# Altium schematic sheet PWR.SchDoc
size A; SheetNumber: 3; SheetTotal: 5
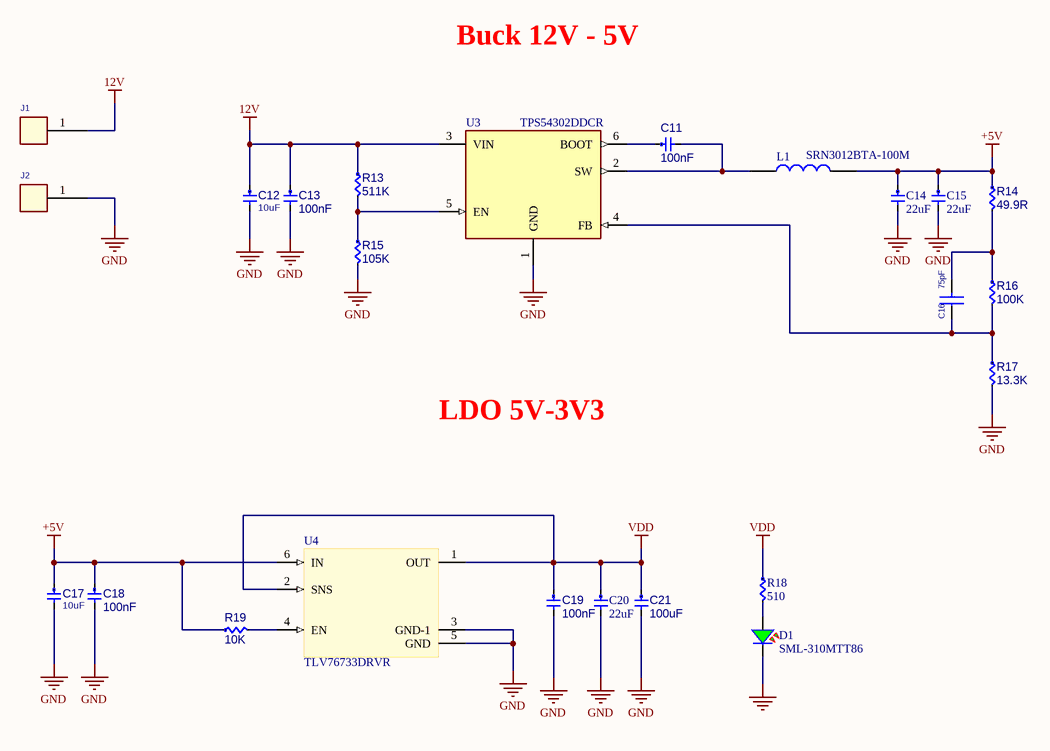
[diagram p0: PWR.SchDoc]

## Parts
C11  Capacitance: 100nF  [CAP0402]  (hidden comment: CC0402KRX5R9BB104)
C12  Capacitance: 10uF  [CAP0603]  (hidden comment: GRM188R6YA106MA73D)
C13  Capacitance: 100nF  [CAP0402]  (hidden comment: CC0402KRX5R9BB104)
C14  Capacitance: 22uF  [CAP0402]  (hidden comment: GRM158R61A226ME15D)
C15  Capacitance: 22uF  [CAP0402]  (hidden comment: GRM158R61A226ME15D)
C16  75pF  [CAP0402]
C17  Capacitance: 10uF  [CAP0603]  (hidden comment: GRM188R6YA106MA73D)
C18  Capacitance: 100nF  [CAP0402]  (hidden comment: CC0402KRX5R9BB104)
C19  Capacitance: 100nF  [CAP0402]  (hidden comment: CC0402KRX5R9BB104)
C20  Capacitance: 22uF  [CAP0402]  (hidden comment: GRM158R61A226ME15D)
C21  Capacitance: 100uF  [CAP0805]  (hidden comment: CL21A107MQYNNWE)
D1  SML-310MTT86  [LED0603 RED]
J1  CON1  [ESC PAD 3X4]  (value not drawn)
J2  CON1  [ESC PAD 3X4]  (value not drawn)
L1  SRN3012BTA-100M  [SRN3012BTA-100M]
R13  511K  [RES0402]
R14  49.9R  [RES0402]
R15  105K  [RES0402]
R16  100K  [RES0402]
R17  13.3K  [RES0402]
R18  Resistance: 510  [RES0402]  (hidden comment: RT0402FRE07510RL)
R19  Resistance: 10K  [RES0402]  (hidden comment: CRCW040210K0JNED)
U3  TPS54302DDCR  [SOT95P280X110-6N - duplicate]
U4  TLV76733DRVR  [SON65P200X200X80-7N - duplicate]

## Nets
12V: C12.1 C13.1 J1.1 R13.1 U3.3(VIN)
+5V: C14.1 C15.1 C17.1 C18.1 L1.2 R14.1 R19.1 U4.6(IN)
GND: C12.2 C13.2 C14.2 C15.2 C17.2 C18.2 C19.2 C20.2 C21.2 D1.1 J2.1 R15.2 R17.2 U3.1(GND) U4.3(GND-1) U4.5(GND)
VDD: C19.1 C20.1 C21.1 R18.1 U4.1(OUT) U4.2(SNS)
NetC11_1: C11.1 U3.6(BOOT)
NetC11_2: C11.2 L1.1 U3.2(SW)
NetC16_1: C16.1 R16.2 R17.1 U3.4(FB)
NetC16_2: C16.2 R14.2 R16.1
NetD1_2: D1.2 R18.2
NetR13_2: R13.2 R15.1 U3.5(EN)
NetR19_2: R19.2 U4.4(EN)

## Notes on the sheet
- Buck 12V - 5V
- LDO 5V-3V3

## Library data of the parts
C11 C13 C18 C19 = CMP-00265-1: CAP CER 0.1UF 50V X5R 0402; Manufacturer: Yageo; Tolerance: 10%; Voltage Rating: 50V; Dielectric: X5R; Width: 0.02inch; Thickness: 0.022inch; Packaging: Tape and Reel; Length: 0.039inch; Mount: Surface Mount; Case/Package: 0402; Min Operating Temperature: -55°C; Halogen Free: Halogen Free; Voltage Rating (DC): 50V; Manufacturer Part Number: CC0402KRX5R9BB104; Max Operating Temperature: 85°C; Lead Free: Lead Free; Manufacturer 1: Yageo; Manufacturer Part Number 1: CC0402KRX5R9BB104
C12 C17 = CMP-01031-1: CAP CER 10UF 35V X5R 0603; Manufacturer 1: Murata Electronics; Tolerance: 20%; Case/Package: 0603; Depth: 0.8mm; Composition: Ceramic; Length: 1.6mm; Max Operating Temperature: 85°C; Lead Free: Lead Free; Thickness: 0.031inch; Number of Pins: 2; Weight: 0.000222oz; Min Operating Temperature: -55°C; REACH SVHC: No SVHC; Case Code (Metric): 1608; Termination: SMD/SMT; Packaging: Tape and Reel; Height: 0.8mm; Voltage Rating (DC): 35V; Width: 0.031inch; Voltage Rating: 35V; Manufacturer Part Number 1: GRM188R6YA106MA73D; Mount: Surface Mount; Package Quantity: 1; Case Code (Imperial): 0603; Dielectric: X5R; Voltage: 35V
C14 C15 C20 = CMP-00520-1: CAP CER 22UF 10V X5R 0402; Manufacturer 1: TDK Corporation; Tolerance: 10%; Case Code (Imperial): 0402; Case/Package: 0402; Voltage: 10V; Min Operating Temperature: -55°C; Termination: SMD/SMT; Voltage Rating: 10V; Length: 1mm; REACH SVHC: No SVHC; Max Operating Temperature: 85°C; Radiation Hardening: No; Depth: 0.5mm; Case Code (Metric): 1005; Dielectric: X5R; Manufacturer Part Number 1: GRM158R61A226ME15D; Packaging: Tape and Reel
C16 = CAP_Dup1_16: CAP CER 75PF 25V C0G/NP0 0402; Manufacturer PN: CC0402JRNPO9BN750; Manufacturer: YAGEO; PART_NUMBER: TMP-416; CLASS: DISCRETE; Tolerance: 5%; Temperature Coefficient: C0G, NP0; Dielectric Type: Capacitors; Rated Voltage: 25V; Package Size: 0402 (1005 Metric)
C21 = CMP-00446-1: CAP CER 100UF 6.3V X5R 0805; Manufacturer 1: TDK Corporation; Tolerance: 20%; Dielectric Material: Ceramic; Length: 2mm; Dielectric: X5R; Height: 1.25mm; Width: 0.049inch; Depth: 1.25mm; Voltage Rating (DC): 6.3V; Manufacturer Part Number 1: CL21A107MQYNNWE; REACH SVHC: No SVHC; Weight: 0.000194oz; Package Quantity: 2000; Mount: Surface Mount; Packaging: Tape and Reel; Case Code (Imperial): 0805; Thickness: 0.057inch; Max Operating Temperature: 85°C; Case/Package: 0805; Case Code (Metric): 2012; Voltage Rating: 6.3V; Termination: SMD/SMT; Composition: Ceramic; Lead Free: Lead Free; Min Operating Temperature: -55°C
D1 = CMP-01130-2: LED GREEN CLEAR 0603 SMD; Manufacturer 1: Rohm Semiconductor; Luminous Intensity: 16mcd; Wavelength: 570nm; Number of LEDs: 1; Color: Green,Yellow; Forward Voltage: 2.2V; Lens Color: Colorless,Clear; Forward Current: 20mA; Viewing Angle: 140°; Lens Style: Rectangular,Clear,Diffused,Colorless; Case Code (Imperial): 0603; Lens Transparency: Clear; Package Quantity: 3000; Width: 0.8mm; Manufacturer Part Number 1: SML-310MTT86; Min Operating Temperature: -30°C; Length: 1.6mm; Packaging: Tape and Reel; Dominant Wavelength: 570nm; Height: 0.9mm; Radiation Hardening: No; Test Current: 20mA; Case Code (Metric): 1608; Lead Free: Lead Free; Case/Package: 0603; Mount: Surface Mount; Max Operating Temperature: 85°C; Illumination Color: Green; Number of Pins: 2
J1 J2 = CON1: SOLDER PADS
L1 = SRN3012BTA-330M: 10uH; Manufacturer_Name: Bourns; Geometry.Height: 1.2mm; Mouser Part Number: SRN3012BTA-100M; Mouser Price/Stock: https://www.mouser.co.uk/ProductDetail/Bourns/SRN3012BTA-330M?qs=Imq1NPwxi74rPoSZ4PPaRw%3D%3D; Manufacturer_Part_Number: SRN3012BTA-100M; Datasheet Link: https://www.bourns.com/docs/Product-Datasheets/SRN3012BTA.pdf
R13 = CMP-00299-1_1: RES SMD 511K OHM 1% 1/16W 0402; Manufacturer: Yageo; Manufacturer Part Number: RC0402FR-07511KL; Temperature Coefficient: 100ppm/°C; Working Voltage: 50V; Max Power Dissipation: 63mW; Power Rating: 62.5mW; Height: 0.016inch; Package Quantity: 1; Min Operating Temperature: -55°C; Tolerance: 1%; Military Standard: Not; Packaging: Tape and Reel; Number of Terminations: 2; Width: 0.02inch; Case/Package: 0402; Length: 1mm; Voltage Rating (DC): 50V; Case Code (Metric): 1005; Resistance: 511K; Composition: Thick Film; Voltage Rating: 50V; Max Operating Temperature: 155°C; Case Code (Imperial): 0402; Lead Free: Lead Free; Termination: SMD/SMT; Features: Moisture Resistant; Depth: 0.5mm; Manufacturer 1: Yageo; Manufacturer Part Number 1: RC0402FR-07511KL
R14 = CMP-00299-1_1: RES SMD 49.9R OHM 1% 1/16W 0402; Manufacturer: Yageo; Manufacturer Part Number: RC0402FR-0749R9L; Temperature Coefficient: 100ppm/°C; Working Voltage: 50V; Max Power Dissipation: 63mW; Power Rating: 62.5mW; Height: 0.016inch; Package Quantity: 1; Min Operating Temperature: -55°C; Tolerance: 1%; Military Standard: Not; Packaging: Tape and Reel; Number of Terminations: 2; Width: 0.02inch; Case/Package: 0402; Length: 1mm; Voltage Rating (DC): 50V; Case Code (Metric): 1005; Resistance: 49.9R; Composition: Thick Film; Voltage Rating: 50V; Max Operating Temperature: 155°C; Case Code (Imperial): 0402; Lead Free: Lead Free; Termination: SMD/SMT; Features: Moisture Resistant; Depth: 0.5mm; Manufacturer 1: Yageo; Manufacturer Part Number 1: RC0402FR-0749R9L
R15 = CMP-00299-1_1: RES SMD 105K OHM 1% 1/16W 0402; Manufacturer: Yageo; Manufacturer Part Number: RC0402FR-07105KL; Temperature Coefficient: 100ppm/°C; Working Voltage: 50V; Max Power Dissipation: 63mW; Power Rating: 62.5mW; Height: 0.016inch; Package Quantity: 1; Min Operating Temperature: -55°C; Tolerance: 1%; Military Standard: Not; Packaging: Tape and Reel; Number of Terminations: 2; Width: 0.02inch; Case/Package: 0402; Length: 1mm; Voltage Rating (DC): 50V; Case Code (Metric): 1005; Resistance: 105K; Composition: Thick Film; Voltage Rating: 50V; Max Operating Temperature: 155°C; Case Code (Imperial): 0402; Lead Free: Lead Free; Termination: SMD/SMT; Features: Moisture Resistant; Depth: 0.5mm; Manufacturer 1: Yageo; Manufacturer Part Number 1: RC0402FR-07105KL
R16 = CMP-00299-1_1: RES SMD 100K OHM 1% 1/16W 0402; Manufacturer: Yageo; Manufacturer Part Number: RC0402FR-07100KL; Temperature Coefficient: 100ppm/°C; Working Voltage: 50V; Max Power Dissipation: 63mW; Power Rating: 62.5mW; Height: 0.016inch; Package Quantity: 1; Min Operating Temperature: -55°C; Tolerance: 1%; Military Standard: Not; Packaging: Tape and Reel; Number of Terminations: 2; Width: 0.02inch; Case/Package: 0402; Length: 1mm; Voltage Rating (DC): 50V; Case Code (Metric): 1005; Resistance: 100K; Composition: Thick Film; Voltage Rating: 50V; Max Operating Temperature: 155°C; Case Code (Imperial): 0402; Lead Free: Lead Free; Termination: SMD/SMT; Features: Moisture Resistant; Depth: 0.5mm; Manufacturer 1: Yageo; Manufacturer Part Number 1: RC0402FR-07100KL
R17 = CMP-00299-1_1: RES SMD 13.3K OHM 1% 1/16W 0402; Manufacturer: Yageo; Manufacturer Part Number: RC0402FR-0713K3L; Temperature Coefficient: 100ppm/°C; Working Voltage: 50V; Max Power Dissipation: 63mW; Power Rating: 62.5mW; Height: 0.016inch; Package Quantity: 1; Min Operating Temperature: -55°C; Tolerance: 1%; Military Standard: Not; Packaging: Tape and Reel; Number of Terminations: 2; Width: 0.02inch; Case/Package: 0402; Length: 1mm; Voltage Rating (DC): 50V; Case Code (Metric): 1005; Resistance: 13.3K; Composition: Thick Film; Voltage Rating: 50V; Max Operating Temperature: 155°C; Case Code (Imperial): 0402; Lead Free: Lead Free; Termination: SMD/SMT; Features: Moisture Resistant; Depth: 0.5mm; Manufacturer 1: Yageo; Manufacturer Part Number 1: RC0402FR-0713K3L
R18 = RC0402FR-0722KL: RES SMD 510 OHM 1% 1/16W 0402; Manufacturer: Yageo; Power Rating: 62.5mW; Temperature Coefficient: 100ppm/°C; Voltage Rating: 50V; Max Power Dissipation: 63mW; Supplier 1: Future Electronics; Manufacturer Part Number: RT0402FRE07510RL; RoHS: Yes; Category: Chip SMD Resistors; Stock 1: 1010000; Pricing 1: 10000=0.00100, 50000=0.00090, 300000=0.00080, 1000000=0.00080, 3000000=0.00070 (USD); Case/Package: 0402; Case Code (Metric): 1005; Case Code (Imperial): 0402; Min Operating Temperature: -55°C; Max Operating Temperature: 155°C; Tolerance: 1%; Packaging: Tape and Reel; Package Quantity: 1; Resistor Type: Thick Film; Number of Terminations: 2; Termination: SMD/SMT; Working Voltage: 50V; Features: Moisture Resistant; Series: RC; Resistance Tolerance: 1%; Construction: Rectangular; Length: 0.039inch; Width: 0.02inch; Height: 0.016inch; Depth: 0.5mm; Reach SVHC Compliant: Yes; Lead Free: Lead Free; Military Standard: Not; RoHS Compliant: Yes
R19 = CMP-00034-1: RES SMD 10K OHM 5% 1/16W 0402; Manufacturer: Vishay Dale; Voltage Rating: 50V; Power Rating: 63mW; Temperature Coefficient: 200ppm/°C; Max Operating Temperature: 155°C; Width: 0.5mm; Composition: Thick Film; Length: 1mm; Case Code (Imperial): 0402; Case/Package: 0402; Number of Terminations: 2; Mount: Surface Mount; Depth: 0.5mm; Weight: 2.3E-05oz; Radiation Hardening: No; Package Quantity: 1; Case Code (Metric): 1005; REACH SVHC: Unknown; Tolerance: 5%; Features: Automotive AEC-Q200; Max Power Dissipation: 63mW; Height: 0.016inch; Packaging: Tape and Reel; Military Standard: Not; Min Operating Temperature: -55°C; Manufacturer Part Number 1: CRCW040210K0JNED; Contact Plating: Tin; Termination: SMD/SMT
U3 = TPS54302DDCR: 4.5-V to 28-V Input, 3-A Output, EMI Friendly Synchronous Step-Down Converter; MF: Texas Instruments; Package: SOT-23-THN-6 Texas Instruments; Price: None; Check_prices: https://www.snapeda.com/parts/TPS54302DDCR/Texas+Instruments/view-part/?ref=eda; Value: *; SnapEDA_Link: https://www.snapeda.com/parts/TPS54302DDCR/Texas+Instruments/view-part/?ref=snap; MP: TPS54302DDCR; Availability: In Stock; Purchase-URL: https://pricing.snapeda.com/search?q=TPS54302DDCR&ref=eda
U4 = TLV76733DRVR: Adjustable- and fixed-output, 1-A, 16-V, positive-voltage low-dropout (LDO) linear regulator; MF: Texas Instruments; SnapEDA_Link: https://www.snapeda.com/parts/TLV76733DRVR/Texas+Instruments/view-part/?ref=snap; Package: WSON-6 Texas Instruments; Value: *; MP: TLV76733DRVR; Check_prices: https://www.snapeda.com/parts/TLV76733DRVR/Texas+Instruments/view-part/?ref=eda